# Altium schematic sheet Output Mixer.SchDoc
size A4; SheetNumber: 5; SheetTotal: 7
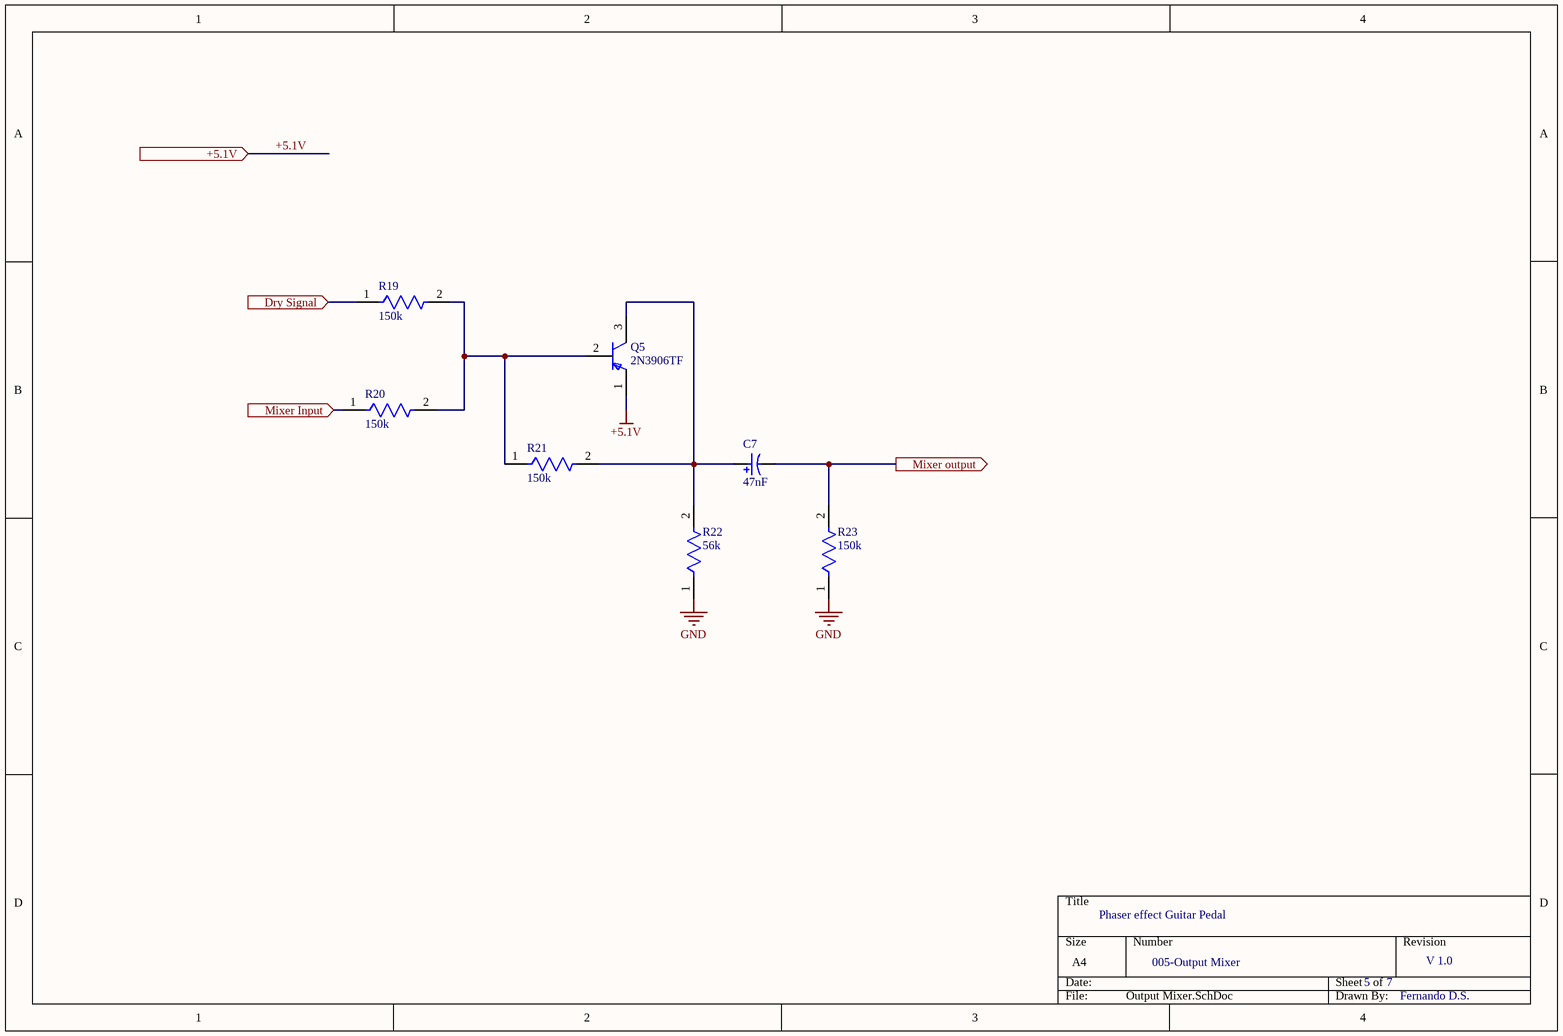
[diagram p0: Output Mixer.SchDoc]

## Parts
C7  47nF  [NIC-PLF-10x13-2_V]
Q5  2N3906TF  [FP-135AR-MFG]
R19  150k  [FP-MRS25-MFG]
R20  150k  [FP-MRS25-MFG]
R21  150k  [FP-MRS25-MFG]
R22  56k  [FP-MRS25-MFG]
R23  150k  [FP-MRS25-MFG]

## Ports
+5.1V (in, see Main[3B], Input Buffer[1A], LFO[1A], Phase Shifting Stage[1A], Power supply[3A]), Dry Signal (in, see Main[3B]), Mixer Input (in, see Main[3B]), Mixer output (out, see Main[4B])

## Nets
+5.1V: Q5.1(E) ; port +5.1V
GND: R22.1 R23.1
Dry Signal: R19.1 ; port Dry Signal
Mixer Input: R20.1 ; port Mixer Input
Mixer output: C7.2 R23.2 ; port Mixer output
NetC7_1: C7.1 Q5.3(C) R21.2 R22.2
NetQ5_2: Q5.2(B) R19.2 R20.2 R21.1

## Notes on the sheet
- Phaser effect Guitar Pedal
- 005-Output Mixer
- 5
- 7
- V 1.0
- Fernando D.S.

## Library data of the parts
C7 = CMP-1234-00001-1: Aluminum Electrolytic Capacitor, 470 uF +/-20%, 10 V, -55 to 105 degC, 2-Pin THD, RoHS; Manufacturer: Nichicon; PartNumber: PLF1A471MDO1; Leakage Current: 0.94 mA; Rated Ripple: 5700 mA; Rated Voltage: 10 V; Rated Capacitance: 470 uF; ComponentLink3URL: http://nichicon-us.com/english/products/pdfs/e-lf.pdf; PackageDescription: 2-Pin Through Hole Device, Dia 10 mm, Body Length 13 mm, Pin Spacing 5 mm; ComponentLink2URL: http://nichicon-us.com/english/products/pdfs/e-lf.pdf; RoHS: TRUE; ComponentLink1URL: http://www.nichicon.co.jp/; ComponentLink2Description: Datasheet; Capacitance Tolerance: +/-20%; ComponentLink1Description: Manufacturer URL; Mounting Technology: Through Hole; ComponentLink3Description: Package Specification; Temperature Range: -55 to 105 degC; DatasheetVersion: Sep-13
Q5 = CMP-00278-84408866-1: 2N3906TF Small Signal Bipolar Transistor, 0.2A I(C), 40V V(BR)CEO, 1-Element, PNP, Silicon, TO-92; Manufacturer Lifecycle Status: ACTIVE; Collector Base Voltage (VCBO): -40V; Frequency: 250MHz; Number of Elements: 1; Max Power Dissipation: 625mW; Max Breakdown Voltage: 160V; Current Rating: -200mA; Emitter Base Voltage (VEBO): -5V; Collector Emitter Saturation Voltage: -400mV; Element Configuration: Single; Max Junction Temperature (Tj): 150°C; hFE Min: 100; Polarity: PNP; Lead Free: Lead Free; RoHS: Compliant; Max Operating Temperature: 150°C; Collector Emitter Voltage (VCEO): -40V; Max Frequency: 250MHz; Power Dissipation: 625mW; Height: 5.33mm; Schedule B: 8541210080; Mount: Through Hole; Length: 5.2mm; REACH SVHC: No SVHC; Min Operating Temperature: -55°C; Gain Bandwidth Product: 250MHz; Number of Pins: 3; Lifecycle Status: Production; Transition Frequency: 250MHz; NexarPartId: 84408866; Collector Emitter Breakdown Voltage: -40V; Case/Package: TO-92; Packaging: Tape and Reel; Width: 4.19mm; Max Collector Current: -200mA; Radiation Hardening: No; Weight: 240mg; Voltage Rating (DC): -40V
R19-R23 = CMP-00030-42757237-1: MRS25000C1000FRP00 Resistor, 100 Ohm, ± 1%, 600 mW, Axial Leaded, Metal Film (Thin Film), Professional; Max Power Dissipation: 600mW; Resistance: 100Ω; Voltage Rating: 350V; Temperature Coefficient: 50ppm/°C; Lead Diameter: 600µm; RoHS: Compliant; Radiation Hardening: No; Schedule B: 8533210090, 8533210090; Length: 6.5mm; Packaging: Tape & Reel (TR); Number of Terminations: 2; Mount: Through Hole; Width: 2.5mm; Tolerance: 1%; Military Standard: Not; Voltage Rating (DC): 350V; Contact Plating: Tin; Number of Pins: 2; Max Operating Temperature: 155°C; NexarPartId: 42757237; Diameter: 2.5mm; Composition: Metal Film, Thin Film; REACH SVHC: Unknown; Power Rating: 600mW; Lead Free: Lead Free; Termination: Axial; Case/Package: Axial; Min Operating Temperature: -55°C